# Altium schematic sheet Connectors.SchDoc
size A3; Author: HamidFijani; DrawnBy: HamidFijani; SheetNumber: 12; SheetTotal: 13
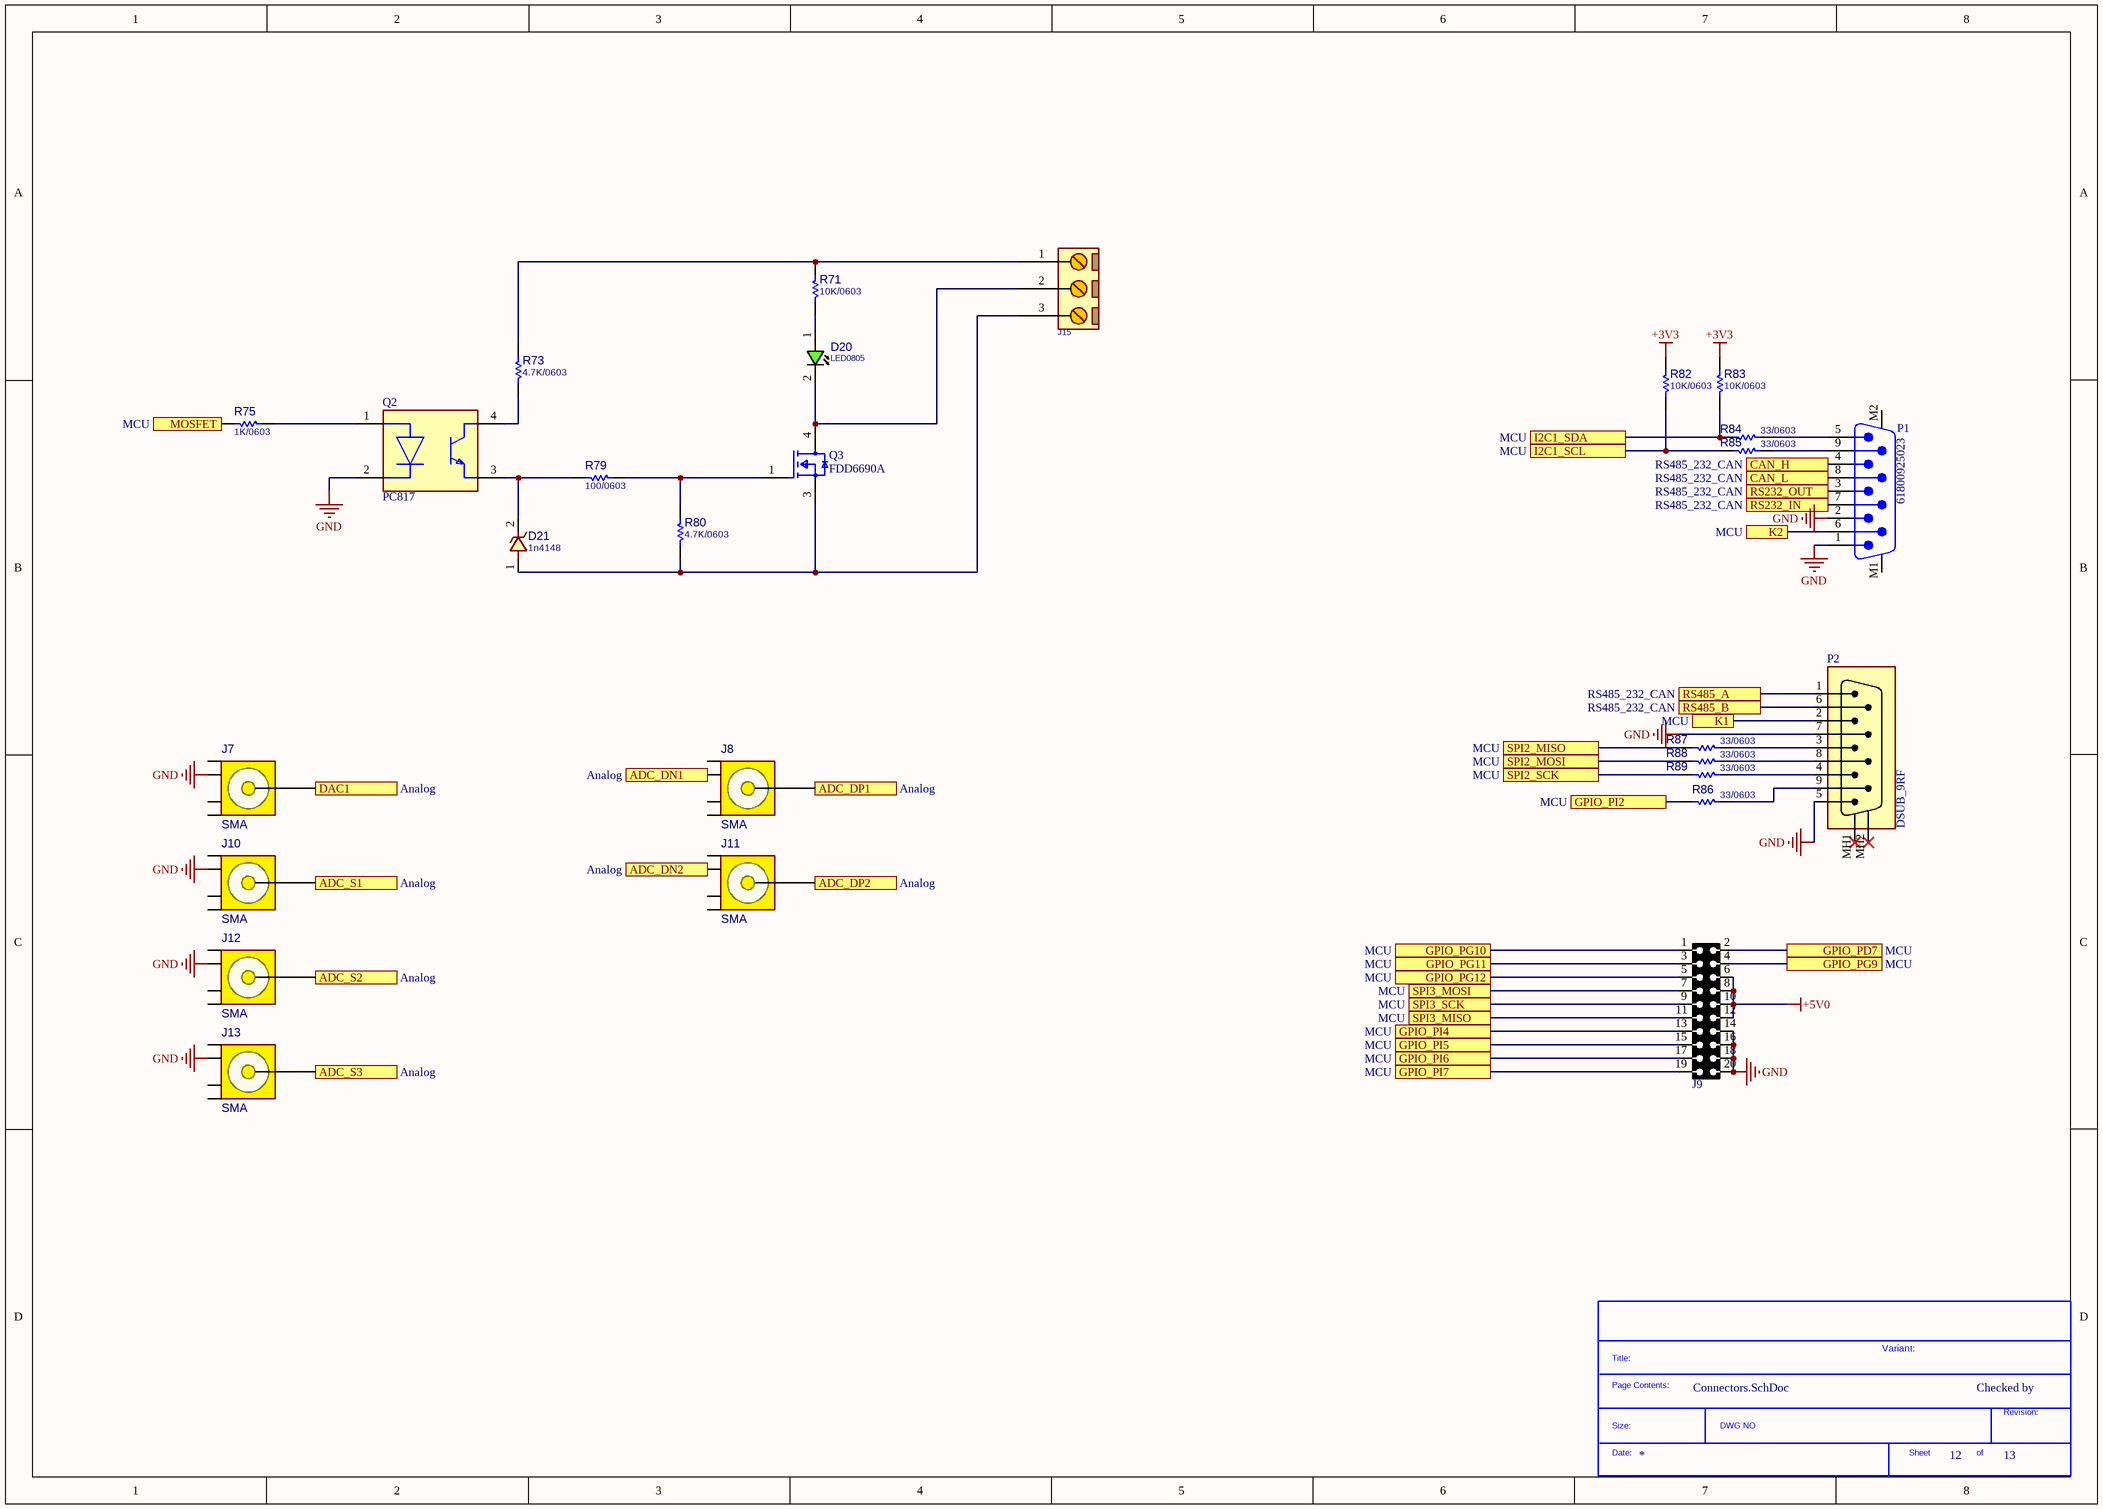
[diagram p0: Connectors.SchDoc]

## Parts
?  (no value)  (graphical)
D20  LED0805  [LED0805]
D21  1n4148  [D_SOD123W]
J7  SMA  [SMA_RA]
J8  SMA  [SMA_ST]
J9  HDRMINI_2X10  [HDRMINI_F_2X10]  (value not drawn)
J10  SMA  [SMA_RA]
J11  SMA  [SMA_RA]
J12  SMA  [SMA_ST]
J13  SMA  [SMA_ST]
J15  CONN_TB3  [MSTB_3]  (value not drawn)
P1  61800925023  [61800925023]
P2  DSUB_9RF  [DSUB_9RF]
Q2  PC817  [FP-PC817XNNIP0F-MFG]
Q3  FDD6690A  [FP-369AS-MFG]
R71  10K/0603  [R0603]
R73  4.7K/0603  [R0603]
R75  1K/0603  [R0603]
R79  100/0603  [R0603]
R80  4.7K/0603  [R0603]
R82  10K/0603  [R0603]
R83  10K/0603  [R0603]
R84  33/0603  [R0603]
R85  33/0603  [R0603]
R86  33/0603  [R0603]
R87  33/0603  [R0603]
R88  33/0603  [R0603]
R89  33/0603  [R0603]

## Ports
ADC_DN1 (see Analog), ADC_DN2 (see Analog), ADC_DP1 (see Analog), ADC_DP2 (see Analog), ADC_S1 (see Analog), ADC_S2 (see Analog), ADC_S3 (see Analog), CAN_H (see RS485_232_CAN), CAN_L (see RS485_232_CAN), DAC1 (see Analog), GPIO_PD7 (see MCU), GPIO_PG9 (see MCU), GPIO_PG10 (see MCU), GPIO_PG11 (see MCU), GPIO_PG12 (see MCU), GPIO_PI2 (see MCU), GPIO_PI4 (see MCU), GPIO_PI5 (see MCU), GPIO_PI6 (see MCU), GPIO_PI7 (see MCU), I2C1_SCL (see MCU), I2C1_SDA (see MCU), K1 (see MCU), K2 (see MCU), MOSFET (see MCU), RS232_IN (see RS485_232_CAN), RS232_OUT (see RS485_232_CAN), RS485_A (see RS485_232_CAN), RS485_B (see RS485_232_CAN), SPI2_MISO (see MCU), SPI2_MOSI (see MCU), SPI2_SCK (see MCU), SPI3_MISO (see MCU), SPI3_MOSI (see MCU), SPI3_SCK (see MCU)

## Nets
+3V3: R82.1 R83.1
+5V0: J9.6 J9.8 J9.10 J9.12
GND: J7.3(G2) J9.14 J9.16 J9.18 J9.20 J10.3(G2) J12.3(G2) J13.3(G2) P1.1 P1.2 P2.5 P2.7 Q2.2(C)
ADC_DN1: J8.3(G2) ; port ADC_DN1
ADC_DN2: J11.3(G2) ; port ADC_DN2
ADC_DP1: J8.1(SIG) ; port ADC_DP1
ADC_DP2: J11.1(SIG) ; port ADC_DP2
ADC_S1: J10.1(SIG) ; port ADC_S1
ADC_S2: J12.1(SIG) ; port ADC_S2
ADC_S3: J13.1(SIG) ; port ADC_S3
CAN_H: P1.4 ; port CAN_H
CAN_L: P1.8 ; port CAN_L
DAC1: J7.1(SIG) ; port DAC1
GPIO_PD7: J9.2 ; port GPIO_PD7
GPIO_PG9: J9.4 ; port GPIO_PG9
GPIO_PG10: J9.1 ; port GPIO_PG10
GPIO_PG11: J9.3 ; port GPIO_PG11
GPIO_PG12: J9.5 ; port GPIO_PG12
GPIO_PI2: R86.1 ; port GPIO_PI2
GPIO_PI4: J9.13 ; port GPIO_PI4
GPIO_PI5: J9.15 ; port GPIO_PI5
GPIO_PI6: J9.17 ; port GPIO_PI6
GPIO_PI7: J9.19 ; port GPIO_PI7
I2C1_SCL: R82.2 R85.1 ; port I2C1_SCL
I2C1_SDA: R83.2 R84.1 ; port I2C1_SDA
K1: P2.2 ; port K1
K2: P1.6 ; port K2
MOSFET: R75.2 ; port MOSFET
RS232_IN: P1.7 ; port RS232_IN
RS232_OUT: P1.3 ; port RS232_OUT
RS485_A: P2.1 ; port RS485_A
RS485_B: P2.6 ; port RS485_B
SPI2_MISO: R87.1 ; port SPI2_MISO
SPI2_MOSI: R88.1 ; port SPI2_MOSI
SPI2_SCK: R89.1 ; port SPI2_SCK
SPI3_MISO: J9.11 ; port SPI3_MISO
SPI3_MOSI: J9.7 ; port SPI3_MOSI
SPI3_SCK: J9.9 ; port SPI3_SCK
NetD20_1: D20.1(ANODE) R71.2
NetD20_2: D20.2(CATHODE) J15.2 Q3.4(D)
NetD21_1: D21.1 J15.3 Q3.3(S) R80.2
NetD21_2: D21.2 Q2.3(E) R79.2
NetJ15_1: J15.1 R71.1 R73.1
NetP1_5: P1.5 R84.2
NetP1_9: P1.9 R85.2
NetP2_3: P2.3 R87.2
NetP2_4: P2.4 R89.2
NetP2_8: P2.8 R88.2
NetP2_9: P2.9 R86.2
NetQ2_1: Q2.1(A) R75.1
NetQ2_4: Q2.4(C) R73.2
NetQ3_1: Q3.1(G) R79.1 R80.1

Not connected (* = marked no-connect by the designer): J7 2(G1) 4(G3) 5(G4); J8 2(G1) 4(G3) 5(G4); J10 2(G1) 4(G3) 5(G4); J11 2(G1) 4(G3) 5(G4); J12 2(G1) 4(G3) 5(G4); J13 2(G1) 4(G3) 5(G4); P1 M1 M2; P2 MH1* MH2*

## Notes on the sheet
- Title:
- Page Contents:
- Variant:
- Checked by
- Size:
- Date:
- DWG NO
- Sheet
- of
- Revision:

## Library data of the parts
? = SDTitleBlock
D20 = LED_SMD_0805: LED, SMD, 0805; DESC: DESCRIPTION; MANF_P#: MANF_PART#; PARAM2: 2.2V; MANF: MANF; ASSEMBLY: ASSEMBLY; PRICE: PRICE; VALUE: LED0805
D21 = DIODE_SMD_ZENER_DFLZ5V6: DIODE, ZENER, 1W, 5.1V; MANF: Diodes; DESC: DESCRIPTION; PARAM2: 1W, 4Ohm, -55~150oC; PARAM: 5.6V; MANF_P#: DFLZ5V6-7; ASSEMBLY: ASSEMBLY; PRICE: 0.5$; VALUE: 1n4148
J7 J10 J11 = CONN_RF_SMA_RA: CONN, RF, SMA, Right Angle; MANF_P#: SMA-J-P-H-RA-TH1; MANF: Samtec; PARAM: 50Ohm, 20GHz; DESC: DESCRIPTION; DIST#: DIGIKEY; PARAM2: GOLD; ASSEMBLY: ASSEMBLY; PRICE: 6.3$; VALUE: SMA
J8 J12 J13 = CONN_RF_SMA_ST: CONN, RF, SMA, STRAIGHT; MANF_P#: 142-0701-201; MANF: Johnson; PARAM: 50Ohm, 18GHz; DESC: DESCRIPTION; DIST#: MOUSER; PARAM2: GOLD; ASSEMBLY: ASSEMBLY; PRICE: 2.7$; VALUE: SMA
J9 = HDRMINI_F_2X10: CONN, HEADER, Female, pitch: 1.27mm,; VALUE: HDRMINI_2X10
J15 = CONN_MSTB_3: CONN, PHOENIX MSTB, 5-G, 5.08mm pitch; PARAM2: 320V; PARAM: 12A; VALUE: CONN_TB3
P1 = CMP-1502-00276-2: NexarPartId: 18818192; Pitch: 2.84mm; Current Rating: 3A; Operating Supply Voltage: 125V; Insulation Resistance: 5GΩ; Number of Contacts: 9; Gender: Male; Contact Resistance: 30mΩ; Connector Type: D-Sub; REACH SVHC: Unknown; Min Operating Temperature: -40°C; Mount: Through Hole; Width: 12.5mm; Number of Rows: 2; Number of Pins: 9; RoHS: Compliant; Housing Material: Steel; Depth: 10.9mm; Orientation: Vertical; Contact Plating: Gold; Length: 30.81mm; Insulation Material: PBT; Max Operating Temperature: 85°C; Voltage Rating: 125V; Termination: SMD/SMT
P2 = CONN_DSUB_9RF: CONN, DSUB, HD, 9PIN, R/A, FEMALE, THD; MANF_P#: -; MANF: -; VALUE: DSUB_9RF
Q2 = CMP-65434-000005-1: OPTOISOLATOR 5KV TRANS 4SMD; Reverse Breakdown Voltage: 6V; Output Current per Channel: 30mA; Power Dissipation: 200mW; Collector-emitter Voltage-Max: 200mV; Max Output Voltage: 80V; Input Current: 50mA; Forward Voltage: 1.4V; Fall Time: 18000ns; Number of Elements: 1; Input Type: DC; Packaging: Tape and Reel; RoHS Compliant: Yes; Contact Plating: Copper; Min Operating Temperature: -30°C; Collector Emitter Saturation Voltage: 200mV; Max Input Current: 50mA; Radiation Hardening: No; Max Collector Current: 50mA; Case/Package: SMD/SMT; Mount: Surface Mount; Output Voltage: 80V; Forward Current: 50mA; Max Power Dissipation: 200mW; Collector Emitter Voltage (VCEO): 80V; Number of Channels: 1; Rise Time: 18000ns; Isolation Voltage: 5kV; Number of Pins: 4; Lead Free: Lead Free; Package Quantity: 2000; Isolation Voltage-Max: 5kV; Max Operating Temperature: 100°C
Q3 = CMP-00278-84325831-1: FDD6690A N-Channel PowerTrench® MOSFET, 30V, 46A, 12mΩ; Manufacturer Lifecycle Status: LAST SHIPMENTS; Turn-Off Delay Time: 29ns; Turn-On Delay Time: 10ns; Input Capacitance: 1.23nF; Nominal Vgs: 1.9V; Rise Time: 7ns; Element Configuration: Single; Power Dissipation: 3.3W; Fall Time: 12ns; Gate to Source Voltage (Vgs): 20V; Number of Elements: 1; Max Power Dissipation: 1.5W; Drain to Source Breakdown Voltage: 30V; Lifecycle Status: EOL; NexarPartId: 84325831; Weight: 260.37mg; Mount: Surface Mount; Number of Pins: 3; Rds On Max: 12mΩ; Radiation Hardening: No; Threshold Voltage: 1.9V; Min Operating Temperature: -55°C; Max Operating Temperature: 175°C; Resistance: 12MΩ; Voltage Rating (DC): 30V; REACH SVHC: No SVHC; Case/Package: TO-252; Width: 6.22mm; Current Rating: 46A; Length: 6.73mm; Height: 2.39mm; RoHS: Compliant; Drain to Source Voltage (Vdss): 30V; Lead Free: Lead Free; Packaging: Cut Tape; Drain to Source Resistance: 12mΩ; Continuous Drain Current (ID): 46A; Dual Supply Voltage: 30V
R71 R73 R75 R79 R80 R82-R89 = RES_SMD_0603: RESISTOR, SMD; PARAM: 1%, 0.1W; DESC: DESCRIPTION; DIST#: MOUSER; MANF_P#: -; MANF: -; ASSEMBLY: ASSEMBLY; PRICE: -; PARAM2: -
  R71 R82 R83: VALUE: 10K/0603
  R73 R80: VALUE: 4.7K/0603
  R75: VALUE: 1K/0603
  R79: VALUE: 100/0603
  R84-R89: VALUE: 33/0603